# EAGLE design glcd2usb (EAGLE 5.10)
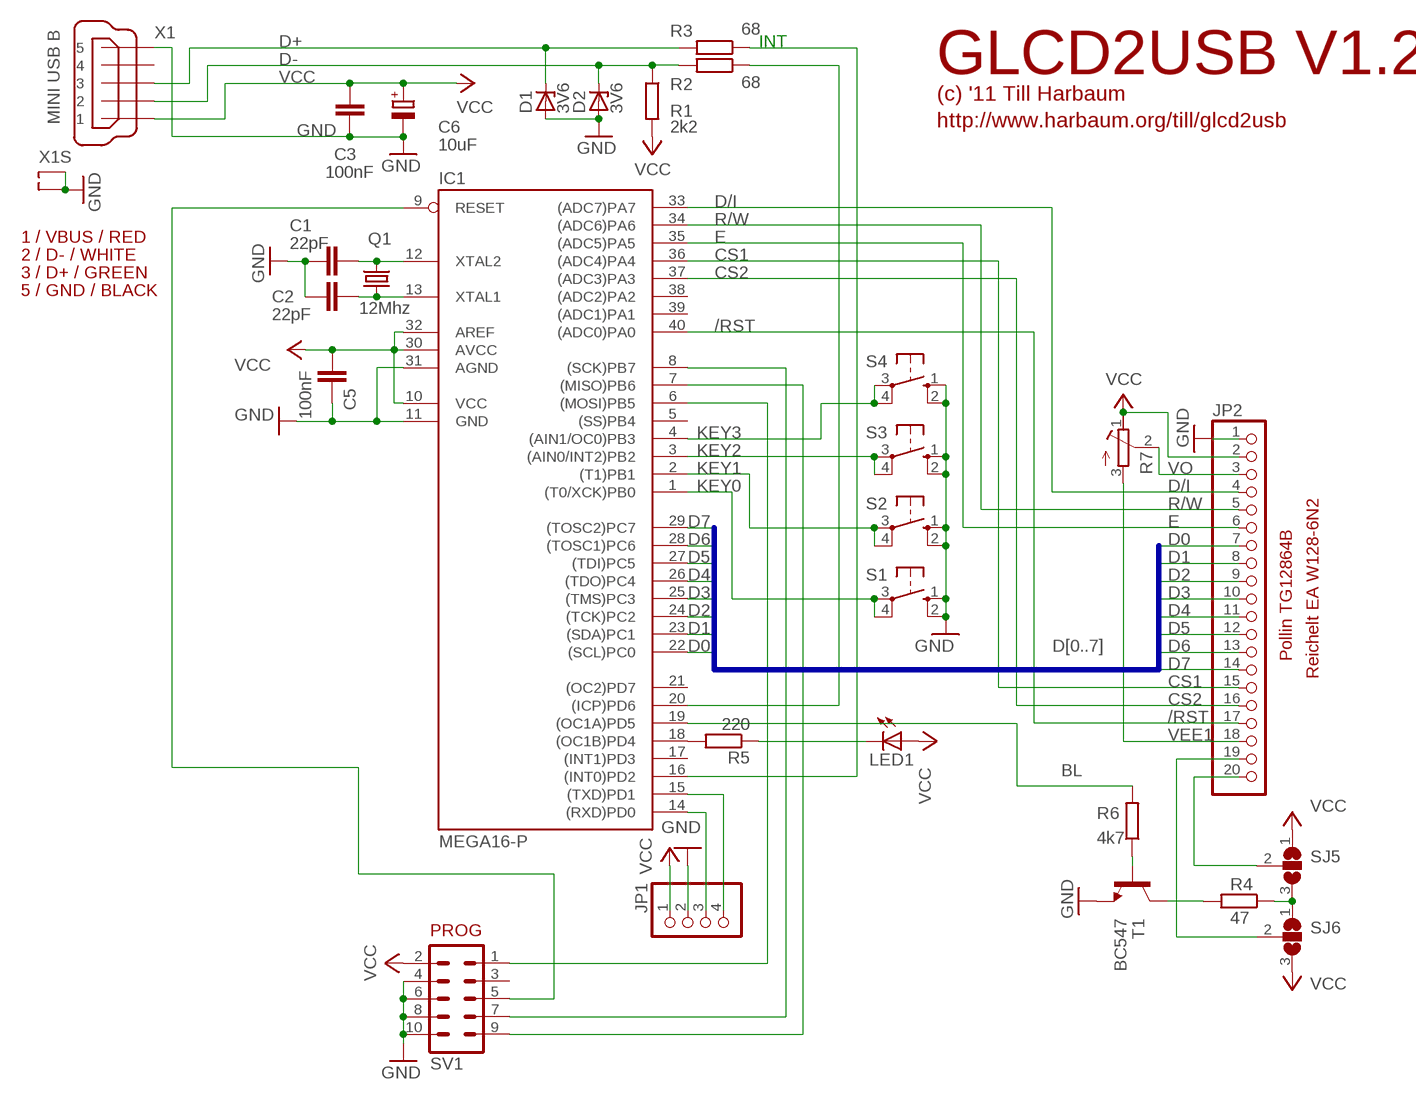
[diagram p0: schematic, sheet 1]

## Parts
C1  22pF  C-EU025-025X050  [C025-025X050]
C2  22pF  C-EU025-025X050  [C025-025X050]
C3  100nF  C-EU050-025X075  [C050-025X075]
C5  100nF  C-EU050-025X075  [C050-025X075]
C6  10uF  CPOL-EUTT2D5L  [TT2D5L]
D1  3V6  ZENER-DIODEDO35Z10  [DO35Z10]
D2  3V6  ZENER-DIODEDO35Z10  [DO35Z10]
IC1  MEGA16-P  [DIL40]
JP1  PINHD-1X4  [1X04]
JP2  PINHD-1X20  [1X20]
LED1  LED3MM  [LED3MM]
Q1  12Mhz  CRYTALHC49S  [HC49/S]
R1  2k2  R-EU_0207/10  [0207/10]
R2  68  R-EU_0207/10  [0207/10]
R3  68  R-EU_0207/10  [0207/10]
R4  47  R-EU_0207/10  [0207/10]
R5  220  R-EU_0207/10  [0207/10]
R6  4k7  R-EU_0207/10  [0207/10]
R7  R-TRIMMT18  [RTRIMT18]
S1  10-XX  [B3F-10XX]
S2  10-XX  [B3F-10XX]
S3  10-XX  [B3F-10XX]
S4  10-XX  [B3F-10XX]
SJ5  SJ2W  [SJ_2]
SJ6  SJ2W  [SJ_2]
SV1  ML10L  [ML10L]
T1  BC547  [TO92]
X1  MINI USB B  MINI-USB_SHIELD5P2-32005-601  [32005-601]

## Nets
/RST: IC1.40((ADC0)PA0) JP2.17
BL: IC1.19((OC1A)PD5) R6.2
CS1: IC1.36((ADC4)PA4) JP2.15
CS2: IC1.37((ADC3)PA3) JP2.16
D0: IC1.22((SCL)PC0) JP2.7
D1: IC1.23((SDA)PC1) JP2.8
D2: IC1.24((TCK)PC2) JP2.9
D3: IC1.25((TMS)PC3) JP2.10
D4: IC1.26((TDO)PC4) JP2.11
D5: IC1.27((TDI)PC5) JP2.12
D6: IC1.28((TOSC1)PC6) JP2.13
D7: IC1.29((TOSC2)PC7) JP2.14
D+: D1.C R3.2 X1.3
D-: D2.C R1.1 R2.2 X1.2
D/I: IC1.33((ADC7)PA7) JP2.4
E: IC1.35((ADC5)PA5) JP2.6
GND: C1.1 C2.1 C3.2 C5.2 C6.- D1.A D2.A IC1.11(GND) IC1.31(AGND) JP1.2 JP2.1 S1.1(S) S1.2(S1) S2.1(S) S2.2(S1) S3.1(S) S3.2(S1) S4.1(S) S4.2(S1) SV1.4 SV1.6 SV1.8 SV1.10 T1.1(E) X1.5 X1.M1(S1) X1.M2(S2)
KEY0: IC1.1((T0/XCK)PB0) S1.3(P) S1.4(P1)
KEY1: IC1.2((T1)PB1) S2.3(P) S2.4(P1)
KEY2: IC1.3((AIN0/INT2)PB2) S3.3(P) S3.4(P1)
KEY3: IC1.4((AIN1/OC0)PB3) S4.3(P) S4.4(P1)
N$1: C1.2 IC1.12(XTAL2) Q1.2
N$2: C2.2 IC1.13(XTAL1) Q1.1
N$4: R4.2 T1.3(C)
N$8: IC1.20((ICP)PD6) R2.1
N$9: IC1.16((INT0)PD2) R3.1
N$10: IC1.6((MOSI)PB5) SV1.1
N$11: IC1.9(RESET) SV1.5
N$12: IC1.8((SCK)PB7) SV1.7
N$13: IC1.7((MISO)PB6) SV1.9
N$16: LED1.K(C) R5.1
N$17: IC1.18((OC1B)PD4) R5.2
N$19: IC1.14((RXD)PD0) JP1.3
N$22: R6.1 T1.2(B)
N$23: IC1.15((TXD)PD1) JP1.4
N$31: JP2.19 SJ6.2
N$32: JP2.20 SJ5.2
N$33: R4.1 SJ5.3 SJ6.1
R/W: IC1.34((ADC6)PA6) JP2.5
VCC: C3.1 C5.1 C6.+ IC1.10(VCC) IC1.30(AVCC) IC1.32(AREF) JP1.1 JP2.2 LED1.A R1.2 R7.1(A) SJ5.1 SJ6.3 SV1.2 X1.1
VEE1: JP2.18 R7.3(E)
VO: JP2.3 R7.2(S)
Unconnected: IC1.5((SS)PB4) IC1.17((INT1)PD3) IC1.21((OC2)PD7) IC1.38((ADC2)PA2) IC1.39((ADC1)PA1) SV1.3 X1.4

## Buses
D[0..7]

## Notes on the sheet
- INT
- GLCD2USB V1.2
- (c) '11 Till Harbaum
- http://www.harbaum.org/till/glcd2usb
- 1 / VBUS / RED
- 2 / D- / WHITE
- 3 / D+ / GREEN
- 5 / GND / BLACK
- Pollin TG12864B
- Reichelt EA W128-6N2
- PROG

## Library data of the parts
C1-C3 C5 = rcl:C-EU: CAPACITOR, European symbol
C6 = rcl:CPOL-EU: POLARIZED CAPACITOR, European symbol
D1 D2 = diode:ZENER-DIODE: Z-Diode
IC1 = atmel:MEGA16-P: MICROCONTROLLER 16 Kbytes FLASH 1 kbytes SRAM 512 bytes EEPROM USART 8-channel 10 bit ADC Source: avr.lbr
JP1 = pinhead:PINHD-1X4: PIN HEADER
JP2 = pinhead:PINHD-1X20: PIN HEADER
LED1 = led:LED: LED OSRAM: - CHIPLED LG R971, LG N971, LY N971, LG Q971, LY Q971, LO R971, LY R971 LH N974, LH R974 LS Q976, LO Q976, LY Q976 LO Q996 - Hyper CHIPLED LW Q18S LB Q993, LB Q99A, LB R99A - SideLED LS A670, LO A670, LY A670, LG A670, LP A670 LB A673, LV A673, LT A673, LW A673 LH A674 LY A675 LS A676, LA A676, LO A676, LY A676, LW A676 LS A679, LY A679, LG A679 - Hyper Micro SIDELED® LS Y876, LA Y876, LO Y876, LY Y876 LT Y87S - SmartLED LW L88C, LW L88S LB L89C, LB L89S, LG L890 LS L89K, LO L89K, LY L89K LS L896, LA L896, LO L896, LY L896 - TOPLED LS T670, LO T670, LY T670, LG T670, LP T670 LSG T670, LSP T670, LSY T670, LOP T670, LYG T670 LG T671, LOG T671, LSG T671 LB T673, LV T673, LT T673, LW T673 LH T674 LS T676, LA T676, LO T676, LY T676, LB T676, LH T676, LSB T676, LW T676 LB T67C, LV T67C, LT T67C, LS T67K, LO T67K, LY T67K, LW E67C LS E67B, LA E67B, LO E67B, LY E67B, LB E67C, LV E67C, LT E67C LW T67C LS T679, LY T679, LG T679 LS T770, LO T770, LY T770, LG T770, LP T770 LB T773, LV T773, LT T773, LW T773 LH T774 LS E675, LA E675, LY E675, LS T675 LS T776, LA T776, LO T776, LY T776, LB T776 LHGB T686 LT T68C, LB T68C - Hyper Mini TOPLED® LB M676 - Mini TOPLED Santana® LG M470 LS M47K, LO M47K, LY M47K Source: http://www.osram.convergy.de - LUMILED® LXK2-PW12-R00, LXK2-PW12-S00, LXK2-PW14-U00, LXK2-PW14-V00 LXK2-PM12-R00, LXK2-PM12-S00, LXK2-PM14-U00 LXK2-PE12-Q00, LXK2-PE12-R00, LXK2-PE12-S00, LXK2-PE14-T00, LXK2-PE14-U00 LXK2-PB12-K00, LXK2-PB12-L00, LXK2-PB12-M00, LXK2-PB14-N00, LXK2-PB14-P00, LXK2-PB14-Q00 LXK2-PR12-L00, LXK2-PR12-M00, LXK2-PR14-Q00, LXK2-PR14-R00 LXK2-PD12-Q00, LXK2-PD12-R00, LXK2-PD12-S00 LXK2-PH12-R00, LXK2-PH12-S00 LXK2-PL12-P00, LXK2-PL12-Q00, LXK2-PL12-R00 Source: www.luxeon.com
Q1 = crystal:CRYTAL: CRYSTAL
R1-R6 = rcl:R-EU_: RESISTOR, European symbol
R7 = rcl:R-TRIMM: Trimm resistor
S1-S4 = switch-omron:10-XX: OMRON SWITCH
SJ5 SJ6 = jumper:SJ2W: SMD solder JUMPER
SV1 = con-harting-ml:ML10: HARTING
T1 = transistor:BC547: NPN TRANSISTOR
X1 = con-cypressindustries:MINI-USB_SHIELD5P2-: MINI USB-B R/A DIP 5pol. Source: www.cypressindustries.com

## Board
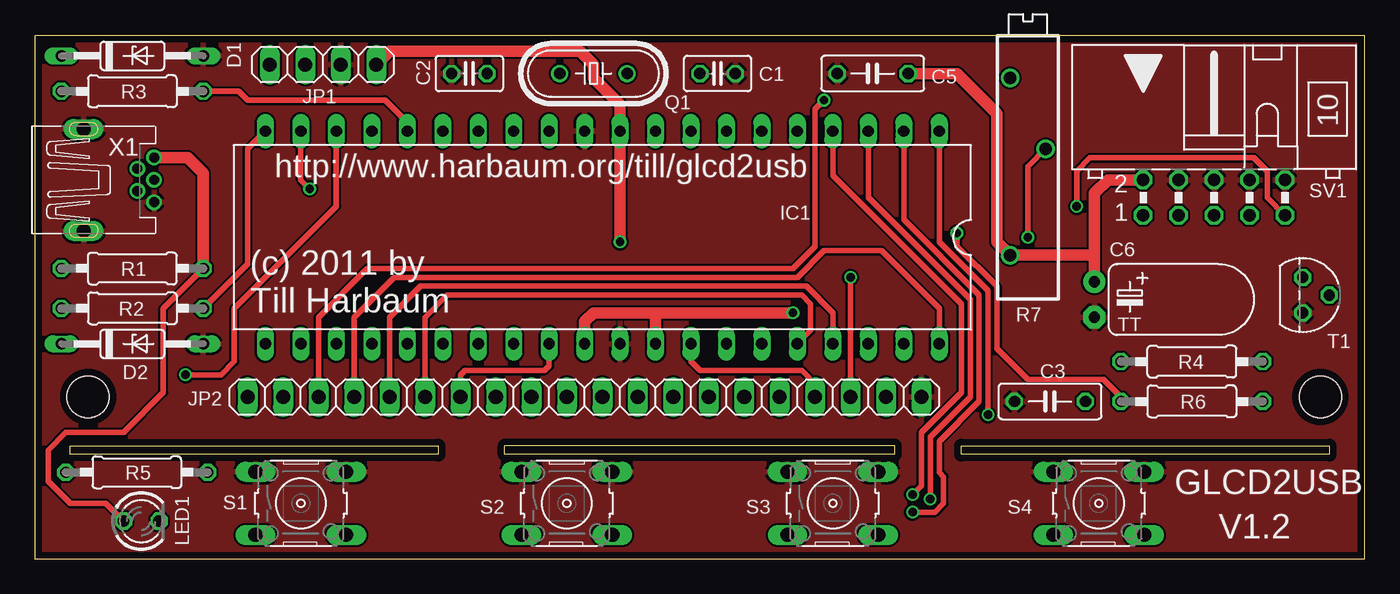
[diagram p1: board, top side]
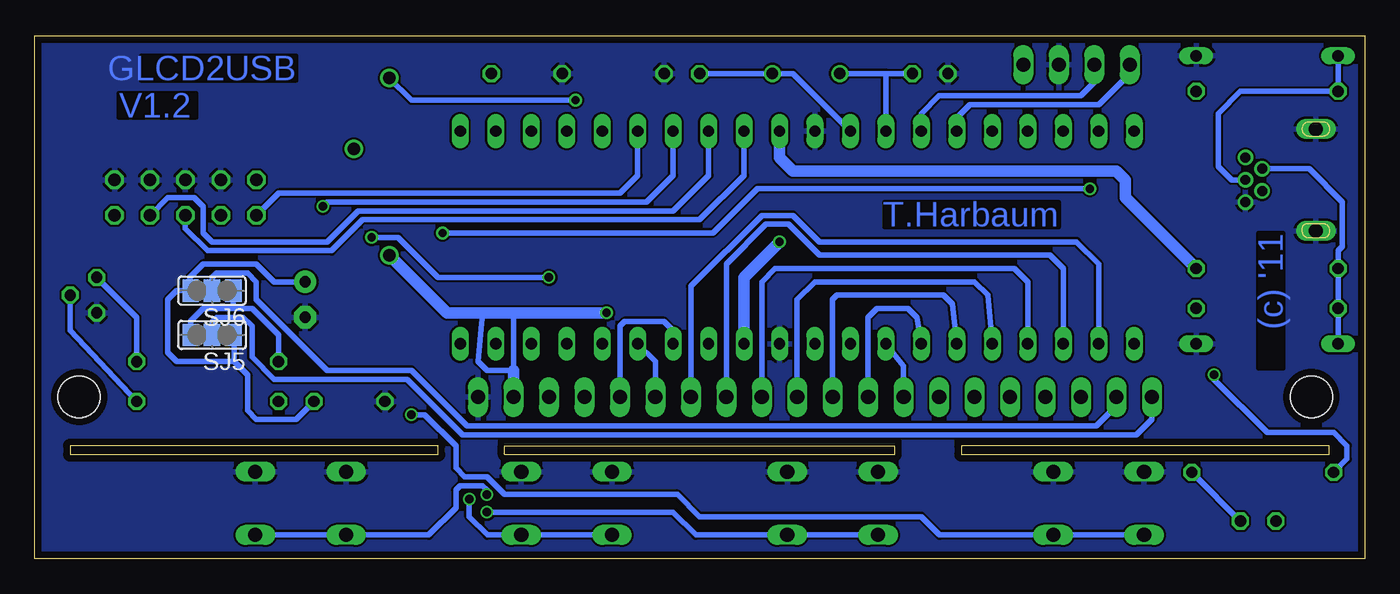
[diagram p2: board, bottom side, seen from below]

Size 95.23 x 37.45 mm. Coordinates in mm from the lower left corner, seen from the top.
Outline: 0,0 95.23,0 95.23,37.45 0,37.45 0,0
Outline: 2.54,8.09 28.89,8.09 28.89,7.46 2.54,7.46 2.54,8.09
Outline: 66.35,8.09 92.7,8.09 92.7,7.46 66.35,7.46 66.35,8.09
Outline: 61.59,7.46 61.59,8.09 33.65,8.09 33.65,7.46 61.59,7.46
Copper layers (1*16): Top 0.035mm / dielectric 1.5mm / Bottom 0.035mm
Design rules "PCB-POOL": minimum track width 6mil, minimum drill 12mil, track to track 6mil, track to pad 6mil, pad to pad 6mil, via to via 6mil, smd to smd 6mil, copper to edge 20mil, drill to drill 8mil, minimum pad ring 8mil, minimum via ring 6mil, stop-mask expansion 3mil, vias tented up to drill 0mil, thermal gap 8mil
Holes 3 mm at 3.81,11.58 92.07,11.58

### Footprints (pad centres in the part's own frame; a part is rotated, then mirrored left to right if it is on the bottom)
C025-025X050 = drill 0.813 octagon: 1 -1.27,0; 2 1.27,0
C050-025X075 = drill 0.813 octagon: 1 -2.54,0; 2 2.54,0
TT2D5L = drill 0.813 pad 1.6 round: + -1.27,0 | drill 0.813 pad 1.6 octagon: - 1.27,0
DO35Z10 = drill 0.813 long: A 5.08,0; C -5.08,0
DIL40 = drill 0.813 long: 1 -24.13,-7.62; 2 -21.59,-7.62; 3 -19.05,-7.62; 4 -16.51,-7.62; 5 -13.97,-7.62; 6 -11.43,-7.62; 7 -8.89,-7.62; 8 -6.35,-7.62; 9 -3.81,-7.62; 10 -1.27,-7.62; 11 1.27,-7.62; 12 3.81,-7.62; 13 6.35,-7.62; 14 8.89,-7.62; 15 11.43,-7.62; 16 13.97,-7.62; 17 16.51,-7.62; 18 19.05,-7.62; 19 21.59,-7.62; 20 24.13,-7.62; 21 24.13,7.62; 22 21.59,7.62; 23 19.05,7.62; 24 16.51,7.62; 25 13.97,7.62; 26 11.43,7.62; 27 8.89,7.62; 28 6.35,7.62; 29 3.81,7.62; 30 1.27,7.62; 31 -1.27,7.62; 32 -3.81,7.62; 33 -6.35,7.62; 34 -8.89,7.62; 35 -11.43,7.62; 36 -13.97,7.62; 37 -16.51,7.62; 38 -19.05,7.62; 39 -21.59,7.62; 40 -24.13,7.62
1X04 = drill 1.016 long: 1 -3.81,0; 2 -1.27,0; 3 1.27,0; 4 3.81,0
1X20 = drill 1.016 long: 1 -24.13,0; 2 -21.59,0; 3 -19.05,0; 4 -16.51,0; 5 -13.97,0; 6 -11.43,0; 7 -8.89,0; 8 -6.35,0; 9 -3.81,0; 10 -1.27,0; 11 1.27,0; 12 3.81,0; 13 6.35,0; 14 8.89,0; 15 11.43,0; 16 13.97,0; 17 16.51,0; 18 19.05,0; 19 21.59,0; 20 24.13,0
LED3MM = drill 0.813 octagon: A -1.27,0; K 1.27,0
HC49/S = drill 0.813 round: 1 -2.413,0; 2 2.413,0
0207/10 = drill 0.813 octagon: 1 -5.08,0; 2 5.08,0
RTRIMT18 = drill 0.9 round: 1 -7.62,1.27; 2 0,-1.27; 3 5.08,1.27
B3F-10XX = drill 1.016 long: 1 -3.251,2.261; 2 3.251,2.261; 3 -3.251,-2.261; 4 3.251,-2.261
SJ_2 = smd 1.168 x 1.6: 1 -1.524,0; 2 0,0; 3 1.524,0
ML10L = drill 0.914 octagon: 1 -5.08,-1.27; 2 -5.08,1.27; 3 -2.54,-1.27; 4 -2.54,1.27; 5 0,-1.27; 6 0,1.27; 7 2.54,-1.27; 8 2.54,1.27; 9 5.08,-1.27; 10 5.08,1.27
TO92 = drill 0.813 octagon: 1 1.27,0; 2 0,1.905; 3 -1.27,0
32005-601 = drill 0.7 pad 1.016 round: 1 2.825,1.6; 2 1.625,0.8; 3 2.825,0; 4 1.625,-0.8; 5 2.825,-1.6 | drill 1 pad 1.422 long: M1 -2.225,3.65; M2 -2.225,-3.65

### Placement (x,y rotation side)
C1  48.89,34.76 180 top
C2  31.11,34.76 0 top
C3  72.7,11.27 180 top
C5  60,34.76 180 top
C6  75.88,18.57 270 top
D1  6.98,36.03 0 top
D2  6.98,15.39 0 top
IC1  40.63,23.01 180 top
JP1  20.63,35.39 180 top
JP2  39.36,11.58 180 top
LED1  7.62,2.69 0 top
Q1  40,34.76 0 top
R1  6.98,20.79 0 top
R2  6.98,17.93 180 top
R3  6.98,33.49 180 top
R4  82.86,14.12 0 top
R5  7.3,6.19 180 top
R6  82.86,11.27 180 top
R7  71.12,29.36 90 top
S1  19.05,3.96 0 top
S2  38.09,3.96 0 top
S3  57.14,3.96 0 top
S4  76.2,3.96 0 top
SJ5  82.55,16.03 180 bottom
SJ6  82.55,19.2 180 bottom
SV1  84.45,25.87 0 top
T1  90.8,18.88 270 top
X1  5.71,27.14 0 top

### Tracks (layer width: path | path; a pad name or v marks a point on that pad's centre or on a via)
/RST
  Top 0.406: JP2.17 22.86,17.3 25.71,20.15 54.6,20.15 56.51,22.06 60.64,22.06 64.77,17.93 IC1.40
BL  (via drill 0.6)
  Top 0.406: IC1.19 19.05,27.14 v19.68,26.51 | R6.2 77.78,11.58 76.51,12.85 71.12,12.85 68.89,15.07 68.89,19.52 66.04,22.38 v66.04,23.33
  Bottom 0.406: v66.04,23.33 46.67,23.33 43.49,26.51 v19.68,26.51
CS1
  Top 0.406: JP2.15 27.94,17.3 29.52,18.88 54.92,18.88 55.56,18.25 55.56,16.35 IC1.36
CS2
  Top 0.406: JP2.16 25.39,17.3 27.62,19.52 55.24,19.52 57.14,17.62 IC1.37
D0
  Bottom 0.406: IC1.22 19.05,21.11 20.63,22.69 39.05,22.69 40.95,24.6 43.17,24.6 48.25,19.52 JP2.7
D1
  Bottom 0.406: IC1.23 21.59,20.79 22.54,21.74 39.05,21.74 41.27,23.97 42.86,23.97 45.71,21.11 JP2.8
D2
  Bottom 0.406: IC1.24 24.12,19.84 25.08,20.79 42.22,20.79 43.17,19.84 JP2.9
D3
  Bottom 0.406: IC1.25 26.98,18.88 27.94,19.84 39.36,19.84 40.63,18.57 JP2.10
D4
  Bottom 0.406: IC1.26 29.52,18.25 30.16,18.88 37.78,18.88 38.09,18.57 JP2.11
D5
  Bottom 0.406: IC1.27 32.06,17.3 32.7,17.93 34.92,17.93 35.55,17.3 JP2.12
D6
  Bottom 0.406: IC1.28 33.02,13.8 JP2.13
D7
  Top 0.406: JP2.14 30.48,13.17 30.79,13.49 36.51,13.49 36.82,13.8 IC1.29
D+
  Bottom 0.406: D1.C R3.2 8.88,33.49 10.47,31.9 10.47,28.09 9.52,27.14 X1.3
D-
  Bottom 0.406: D2.C R2.2 R1.1 1.9,22.06 1.58,22.38 1.58,25.55 3.97,27.94 X1.2
D/I
  Top 0.406: JP2.4 55.88,12.54 54.92,13.49 47.62,13.49 46.98,14.12 IC1.33
E
  Bottom 0.406: JP2.6 50.79,14.12 IC1.35
GND
  pour Top: -0.01,0.15 -0.01,37.62 95.25,37.62 95.25,0.15
  pour Bottom: -0.01,0.15 -0.01,37.62 95.25,37.62 95.25,0.15
KEY0  (via drill 0.6)
  Top 0.406: IC1.1 64.77,22.69 68.26,19.2 v68.26,10.31
  Bottom 0.406: S1.3 22.18,1.7 22.22,1.74 22.26,1.7 S1.4 30.44,1.7 31.75,3.01 47.62,3.01 49.21,4.6 61.59,4.6 62.86,5.87 64.45,5.87 65.08,6.5 65.08,8.09 67.31,10.31 v68.26,10.31
KEY1  (via drill 0.6)
  Top 0.406: IC1.2 62.22,24.28 67.62,18.88 67.62,11.27 64.77,8.41 64.77,6.19 65.08,5.87 65.08,3.96 64.45,3.33 v62.86,3.33
  Bottom 0.406: S2.3 41.23,1.7 41.27,1.74 41.31,1.7 S2.4 47.9,1.7 49.52,3.33 v62.86,3.33
KEY2  (via drill 0.6)
  Top 0.406: IC1.3 59.68,25.87 66.99,18.57 66.99,11.58 64.13,8.72 v64.13,4.28
  Bottom 0.406: S3.3 60.28,1.7 60.32,1.74 60.36,1.7 S3.4 62.82,1.7 64.13,3.01 v64.13,4.28
KEY3  (via drill 0.6)
  Top 0.406: IC1.4 57.14,27.46 66.35,18.25 66.35,11.9 63.49,9.04 63.49,5.23 v62.86,4.6
  Bottom 0.406: S4.4 79.41,1.7 79.37,1.74 79.33,1.7 S4.3 67.03,1.7 65.08,3.65 65.08,4.91 64.77,5.23 63.18,5.23 62.86,4.91 v62.86,4.6
N$1
  Bottom 0.406: IC1.12 40.95,34.76 Q1.2 | Q1.2 42.54,34.76 | Q1.2 C1.2
N$2
  Bottom 0.406: 37.78,34.76 Q1.1 34.28,34.76 | 34.28,34.76 C2.2 | IC1.13 34.28,34.76
N$4
  Bottom 0.406: R4.2 87.94,17.3 T1.3
N$8
  Top 0.406: R2.1 15.23,21.11 15.23,29.36 IC1.20
N$9
  Top 0.406: R3.1 14.6,33.49 15.23,32.85 25.08,32.85 26.67,31.27 IC1.16
N$10
  Bottom 0.406: SV1.1 77.78,26.19 53.34,26.19 52.06,27.46 IC1.6
N$11
  Bottom 0.406: SV1.5 84.45,23.65 82.86,22.06 73.97,22.06 71.75,24.28 47.62,24.28 44.45,27.46 IC1.9
N$12
  Bottom 0.406: IC1.8 46.98,27.46 49.52,24.92 72.07,24.92 74.29,22.69 82.55,22.69 83.18,23.33 83.18,25.24 83.81,25.87 85.72,25.87 SV1.7
N$13  (via drill 0.6)
  Top 0.406: SV1.9 88.26,25.87 88.26,27.78 87.31,28.73 75.56,28.73 74.61,27.78 v74.61,25.24
  Bottom 0.406: IC1.7 49.52,27.46 51.43,25.55 74.29,25.55 v74.61,25.24
N$16
  Bottom 0.406: LED1.K 12.22,6.03 R5.1
N$17  (via drill 0.6)
  Top 0.406: IC1.18 21.59,25.24 14.28,17.93 14.28,14.12 13.33,13.17 v10.79,13.17
  Bottom 0.406: R5.2 1.27,7.14 1.27,8.09 2.22,9.04 6.98,9.04 10.79,12.85 v10.79,13.17
N$19
  Bottom 0.406: JP1.3 19.36,34.13 20.32,33.17 30.48,33.17 31.75,31.9 IC1.14
N$22
  Bottom 0.406: R6.1 92.7,16.35 T1.2
N$23
  Bottom 0.406: JP1.4 16.82,34.76 19.05,32.54 28.25,32.54 29.21,31.59 IC1.15
N$31
  Bottom 0.406: JP2.19 17.78,10.95 19.2,9.52 64.29,9.52 68.26,13.49 74.29,13.49 79.37,18.57 79.37,19.84 80.01,20.47 82.23,20.47 82.55,20.15 SJ6.2
N$32
  Bottom 0.406: SJ5.2 82.55,16.98 82.23,17.3 80.32,17.3 79.69,16.66 79.69,14.44 78.1,12.85 68.58,12.85 64.61,8.88 16.35,8.88 15.23,9.99 JP2.20
N$33
  Bottom 0.406: SJ5.3 84.07,17.04 83.18,17.93 80.96,17.93 | R4.1 77.78,16.03 79.69,17.93 80.96,17.93 | SJ6.1 81.02,18 80.96,17.93
R/W
  Bottom 0.406: JP2.5 53.34,16.66 53.02,16.98 50.16,16.98 49.52,16.35 IC1.34
VCC  (via drill 0.6)
  Top 0.406: LED1.A 5.08,3.96 2.54,3.96 0.95,5.55 0.95,7.77 2.22,9.04 6.34,9.04 9.2,11.9 9.2,17.93 R1.2
  Top 0.813: R1.2 12.06,27.62 10.94,28.74 X1.1 | JP1.1 25.39,36.35 39.05,36.35 40,35.39 40,34.44 41.9,32.54 IC1.10 v41.9,22.69 | IC1.30 39.36,16.98 40,17.62 44.45,17.62 | C5.1 66.04,34.76 68.89,31.9 68.89,22.69 R7.1 75.88,21.74 | 75.88,21.74 C6.+ | SV1.2 76.83,27.14 75.88,26.19 75.88,21.74 | IC1.32 44.45,17.62 | 44.45,17.62 v54.29,17.62
  Bottom 0.406: 84.13,19.2 85.09,19.2 85.72,18.57 85.72,14.76 85.09,14.12 80.96,14.12 | SJ5.1 80.96,16.03 80.96,14.12 | 80.96,14.12 80.01,13.17 80.01,10.63 79.37,9.99 76.51,9.99 C3.1 | C6.+ 78.1,19.84 79.37,21.11 83.18,21.11 84.13,20.15 84.13,19.2 | 84.13,19.2 SJ6.3 | 61.27,17.62 60.95,17.62 60.95,13.49 62.86,13.49 63.49,14.12 63.18,17.62
  Bottom 0.813: IC1.10 41.9,28.73 40.95,27.78 17.78,27.78 17.14,27.14 17.14,25.87 R1.2 | IC1.32 44.45,20.15 v41.9,22.69 | R7.1 65.72,17.62 63.18,17.62 61.27,17.62 v54.29,17.62 | 60.95,13.49 JP2.2
VEE1  (via drill 0.6)
  Top 0.406: JP2.18 20.32,17.3 23.81,20.79 54.29,20.79 55.88,22.38 55.88,32.22 v56.51,32.85
  Bottom 0.406: v56.51,32.85 68.26,32.85 R7.3
VO  (via drill 0.6)
  Top 0.406: JP2.3 v58.41,20.15 | v71.12,23.01 71.12,28.09 R7.2
  Bottom 0.406: v58.41,20.15 66.35,20.15 69.21,23.01 v71.12,23.01

### Text on the board
Bottom: GLCD2USB | V1.2 | T.Harbaum | (c) '11
tNames: http://www.harbaum.org/till/glcd2usb | (c) 2011 by | Till Harbaum | GLCD2USB | V1.2